# Altium schematic sheet NANO_STM32F103_3.SchDoc
size A4
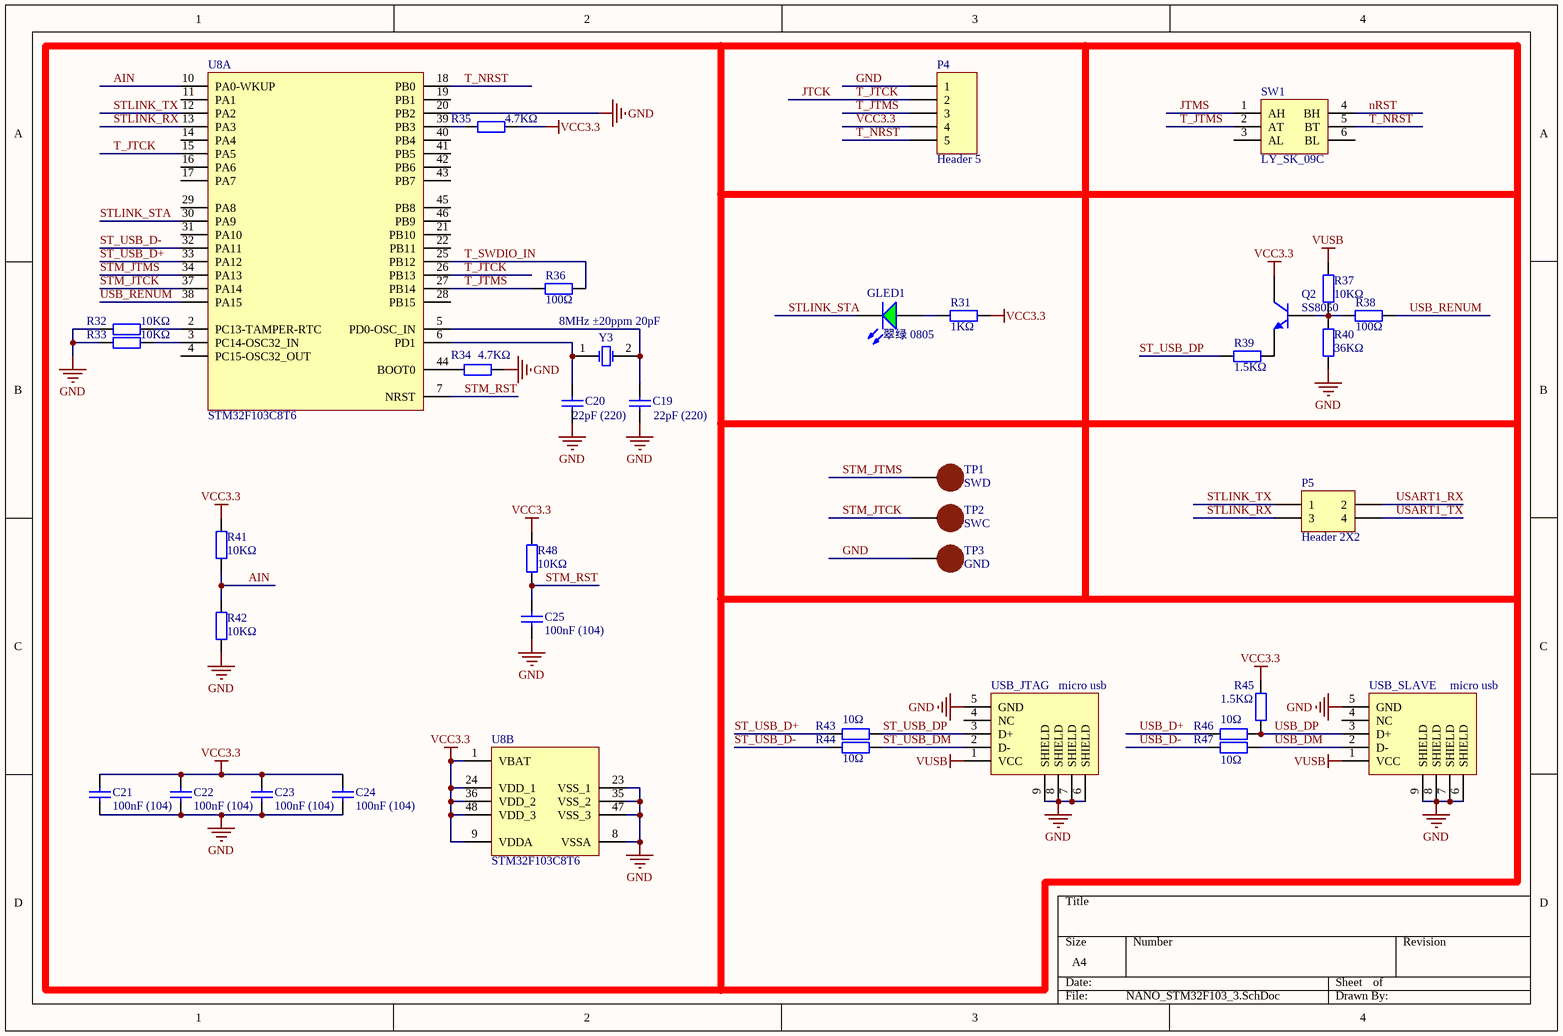
[diagram p0: NANO_STM32F103_3.SchDoc]

## Parts
C19  22pF (220)  [0603_C]
C20  22pF (220)  [0603_C]
C21  100nF (104)  [0603_C]
C22  100nF (104)  [0603_C]
C23  100nF (104)  [0603_C]
C24  100nF (104)  [0603_C]
C25  100nF (104)  [0603_C]
GLED1  翠绿 0805  [0805_LED_S1]
P4  Header 5  [HDR1X5]
P5  Header 2X2  [HDR2X2]
Q2  SS8050  [SOT-23(SOT-23-3)]
R31  1KΩ  [0603_R]
R32  10KΩ  [0603_R]
R33  10KΩ  [0603_R]
R34  4.7KΩ  [0603_R]
R35  4.7KΩ  [0603_R]
R36  100Ω  [0603_R]
R37  10KΩ  [0603_R]
R38  100Ω  [0603_R]
R39  1.5KΩ  [0603_R]
R40  36KΩ  [0603_R]
R41  10KΩ  [0603_R]
R42  10KΩ  [0603_R]
R43  10Ω  [0603_R]
R44  10Ω  [0603_R]
R45  1.5KΩ  [0603_R]
R46  10Ω  [0603_R]
R47  10Ω  [0603_R]
R48  10KΩ  [0603_R]
SW1  LY_SK_09C  [HDR2X3_CEN]
TP1  SWD  [PIN1]
TP2  SWC  [PIN1]
TP3  GND  [PIN1]
U8  STM32F103C8T6  [LQFP-48_7x7x05P]  (parts A,B of 2)
USB_JTAG  micro usb  [USB_Micro]
USB_SLAVE  micro usb  [USB_Micro]
Y3  8MHz ±20ppm 20pF  [SMD-5032_2P]

## Nets
GND: C19.1 C20.1 C21.2 C22.2 C23.2 C24.2 C25.2 P4.1 R32.1 R33.1 R34.2 R40.1 R42.1 TP3.1 U8.8(VSSA) U8.20(PB2) U8.23(VSS_1) U8.35(VSS_2) U8.47(VSS_3) USB_JTAG.5(GND) USB_JTAG.6(SHIELD) USB_JTAG.7(SHIELD) USB_JTAG.8(SHIELD) USB_JTAG.9(SHIELD) USB_SLAVE.5(GND) USB_SLAVE.6(SHIELD) USB_SLAVE.7(SHIELD) USB_SLAVE.8(SHIELD) USB_SLAVE.9(SHIELD)
VCC3.3: C21.1 C22.1 C23.1 C24.1 P4.4 Q2.3(C) R31.2 R35.2 R41.2 R45.2 R48.2 U8.1(VBAT) U8.9(VDDA) U8.24(VDD_1) U8.36(VDD_2) U8.48(VDD_3)
VUSB: R37.2 USB_JTAG.1(VCC) USB_SLAVE.1(VCC)
AIN: R41.1 R42.2 U8.10(PA0-WKUP)
JTCK: P4.2 U8.15(PA5) U8.26(PB13)  [also labelled T_JTCK]
JTMS: SW1.1(AH)
nRST: SW1.4(BH)
ST_USB_D+: R43.1 U8.33(PA12)
ST_USB_D-: R44.1 U8.32(PA11)
ST_USB_DM: R44.2 USB_JTAG.2(D-)
ST_USB_DP: R39.1 R43.2 USB_JTAG.3(D+)
STLINK_RX: P5.3 U8.13(PA3)
STLINK_STA: GLED1.K U8.30(PA9)
STLINK_TX: P5.1 U8.12(PA2)
STM_JTCK: TP2.1 U8.37(PA14)
STM_JTMS: TP1.1 U8.34(PA13)
STM_RST: C25.1 R48.1 U8.7(NRST)
T_JTMS: P4.3 R36.1 SW1.2(AT) U8.27(PB14)
T_NRST: P4.5 SW1.5(BT) U8.18(PB0)
T_SWDIO_IN: R36.2 U8.25(PB12)
USART1_RX: P5.2
USART1_TX: P5.4
USB_D+: R46.1
USB_D-: R47.1
USB_DM: R47.2 USB_SLAVE.2(D-)
USB_DP: R45.1 R46.2 USB_SLAVE.3(D+)
USB_RENUM: R38.2 U8.38(PA15)
NetC19_2: C19.2 U8.5(PD0-OSC_IN) Y3.2(OSC2)
NetC20_2: C20.2 U8.6(PD1) Y3.1(OSC1)
NetGLED1_A: GLED1.A R31.1
NetQ2_1: Q2.1(B) R37.1 R38.1 R40.2
NetQ2_2: Q2.2(E) R39.2
NetR32_2: R32.2 U8.2(PC13-TAMPER-RTC)
NetR33_2: R33.2 U8.3(PC14-OSC32_IN)
NetR34_1: R34.1 U8.44(BOOT0)
NetR35_1: R35.1 U8.39(PB3)

Not connected (* = marked no-connect by the designer): SW1 3(AL) 6(BL); U8 4(PC15-OSC32_OUT) 11(PA1) 14(PA4) 16(PA6) 17(PA7) 19(PB1) 21(PB10) 22(PB11) 28(PB15) 29(PA8) 31(PA10) 40(PB4) 41(PB5) 42(PB6) 43(PB7) 45(PB8) 46(PB9); USB_JTAG 4(NC); USB_SLAVE 4(NC)

## Library data of the parts
C19 C20 = 0603 22pF (220) 5% 50V: 贴片电容; ComponentLink1Description: 供应商链接; ComponentLink1URL: http://www.szlcsc.com/product/details_2005.html; Package: 0603; Supplier: LC; SuppliersPartNumber: C1653
C21-C25 = 0603 100nF (104) 10% 50V: 贴片电容; ComponentLink1Description: 供应商链接; ComponentLink1URL: http://www.szlcsc.com/product/details_15331.html; Package: 0603; Supplier: LC; SuppliersPartNumber: C14663
GLED1 = 0805 翠绿: 发光二极管; ComponentLink1Description: 供应商链接; ComponentLink1URL: http://www.szlcsc.com/product/details_2670.html; Package: 0805; Supplier: LC; SuppliersPartNumber: C2297
P4 = Header 5: Header, 5-Pin; LatestRevisionDate: 17-Jul-2002; LatestRevisionNote: Re-released for DXP Platform.; Publisher: Altium Limited
P5 = Header 2X2: Header, 2-Pin, Dual row; LatestRevisionDate: 17-Jul-2002; LatestRevisionNote: Re-released for DXP Platform.; Publisher: Altium Limited
Q2 = SOT-23 SS8050 Y1: NPN三极管; ComponentLink1Description: 供应商链接; ComponentLink1URL: http://www.szlcsc.com/product/details_2507.html; Package: SOT-23; Supplier: LC; SuppliersPartNumber: C2150
R31 = 0603 1KΩ (1001) 1%: 贴片电阻; ComponentLink1Description: 供应商链接; ComponentLink1URL: http://www.szlcsc.com/product/details_21904.html; Package: 0603; Supplier: LC; SuppliersPartNumber: C21190
R32 R33 R37 R41 R42 R48 = 0603 10KΩ (1002) 1%: 贴片电阻; ComponentLink1Description: 供应商链接; ComponentLink1URL: http://www.szlcsc.com/product/details_26547.html; Package: 0603; Supplier: LC; SuppliersPartNumber: C25804
R34 R35 = 0603 4.7KΩ (4701) 1%: 贴片电阻; ComponentLink1Description: 供应商链接; ComponentLink1URL: http://www.szlcsc.com/product/details_23889.html; Package: 0603; Supplier: LC; SuppliersPartNumber: C23162
R36 R38 = 0603 100Ω (1000) 1%: 贴片电阻; ComponentLink1Description: 供应商链接; ComponentLink1URL: http://www.szlcsc.com/product/details_23502.html; Package: 0603; Supplier: LC; SuppliersPartNumber: C22775
R39 R45 = 0603 1.5KΩ (1501) 1%: 贴片电阻; ComponentLink1Description: 供应商链接; ComponentLink1URL: http://www.szlcsc.com/product/details_23570.html; Package: 0603; Supplier: LC; SuppliersPartNumber: C22843
R40 = 0603 36KΩ (3602) 1%: 贴片电阻; ComponentLink1Description: 供应商链接; ComponentLink1URL: http://www.szlcsc.com/product/details_23874.html; Package: 0603; Supplier: LC; SuppliersPartNumber: C23147
R43 R44 R46 R47 = 0603 10Ω (10R0) 1%: 贴片电阻; ComponentLink1Description: 供应商链接; ComponentLink1URL: http://www.szlcsc.com/product/details_23586.html; Package: 0603; Supplier: LC; SuppliersPartNumber: C22859
SW1 = Switch_1
TP1-TP3 = PAN: 圆形焊盘
U8 = STM32F103C8T6: ARM; ComponentLink1Description: 供应商链接; ComponentLink1URL: http://www.szlcsc.com/product/details_9243.html; Package: LQFP-48_7x7x05P; Supplier: LC; SuppliersPartNumber: C8734
USB_JTAG USB_SLAVE = USB_1
Y3 = SMD-5032_2P 8MHz 20ppm 20pF: 贴片晶振; ComponentLink1Description: 供应商链接; ComponentLink1URL: http://www.szlcsc.com/product/details_117214.html; Package: SMD-5032_2P; Supplier: LC; SuppliersPartNumber: C115962